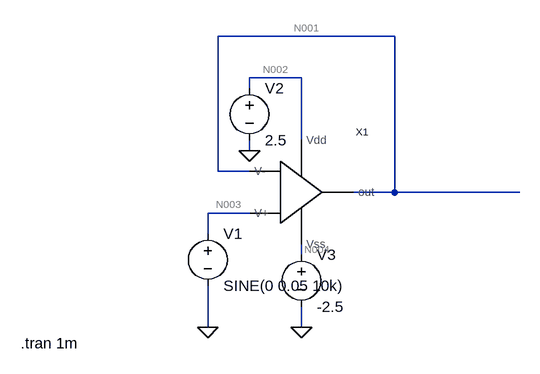
[diagram p0: schematic 2c.asc]
2c.asc, the LTspice schematic file:
Version 4
SHEET 1 880 680
WIRE 400 -96 128 -96
WIRE 256 -32 176 -32
WIRE 176 -16 176 -32
WIRE 256 64 256 -32
WIRE 176 80 176 64
WIRE 128 112 128 -96
WIRE 176 112 128 112
WIRE 400 144 400 -96
WIRE 400 144 336 144
WIRE 592 144 400 144
WIRE 176 176 112 176
WIRE 112 208 112 176
WIRE 256 240 256 224
WIRE 112 352 112 288
WIRE 256 352 256 320
FLAG 112 352 0
FLAG 256 352 0
FLAG 176 80 0
SYMBOL voltage 112 192 R0
WINDOW 123 24 44 Left 2
WINDOW 39 0 0 Left 0
SYMATTR InstName V1
SYMATTR Value SINE(0 0.05 10k)
SYMBOL voltage 176 -32 R0
WINDOW 123 0 0 Left 0
WINDOW 39 0 0 Left 0
SYMATTR InstName V2
SYMATTR Value 2.5
SYMBOL voltage 256 224 R0
WINDOW 123 0 0 Left 0
WINDOW 39 0 0 Left 0
SYMATTR InstName V3
SYMATTR Value -2.5
SYMBOL OPAMP 144 144 R0
SYMATTR InstName X1
TEXT -176 376 Left 2 !.tran 1m

The netlist it stands for:
* 2c.asc
V1 N003 0 SINE(0 0.05 10k)
V2 N002 0 2.5
V3 N004 0 -2.5
XX1 N002 N004 N001 N003 N001 OPAMP  ; pins Vdd Vss V- V+ out
.tran 1m
.backanno
.end

* Results of the author's LTspice run, read from the files saved beside the schematic
* Operating Point, zero values left out:
*   V(n002) = 2.5 V
*   V(n004) = -2.5 V
*   V(n001) = 47.95 µV
*   I(V2) = -188.4 µA
*   I(V3) = 188.4 µA
*   Ix(x1:VDD) = 188.4 µA
*   Ix(x1:VSS) = -188.4 µA
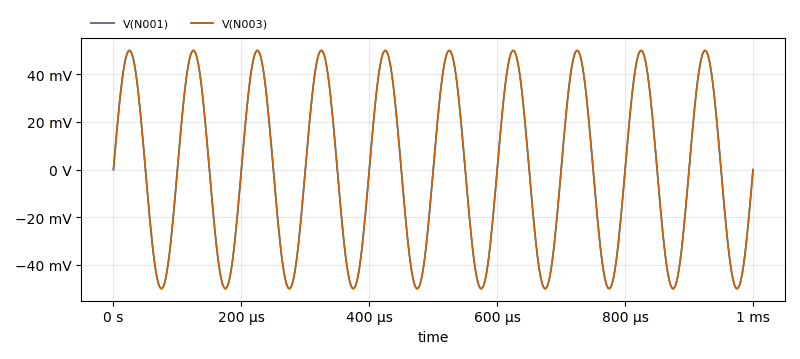
[diagram p1: Transient Analysis of 2c.asc, plotted from the saved traces]
* Transient Analysis, 1 run:
*   V(N001): min -49.89 mV, max 50 mV, average 47.88 µV, rms 35.34 mV, last -27.06 µV
*   V(N003): min -49.99 mV, max 50 mV, average -74.29 nV, rms 35.37 mV, last 0 V